# Altium schematic sheet Front End.SchDoc
size 406 x 304 mm; SheetNumber: 5; SheetTotal: 6
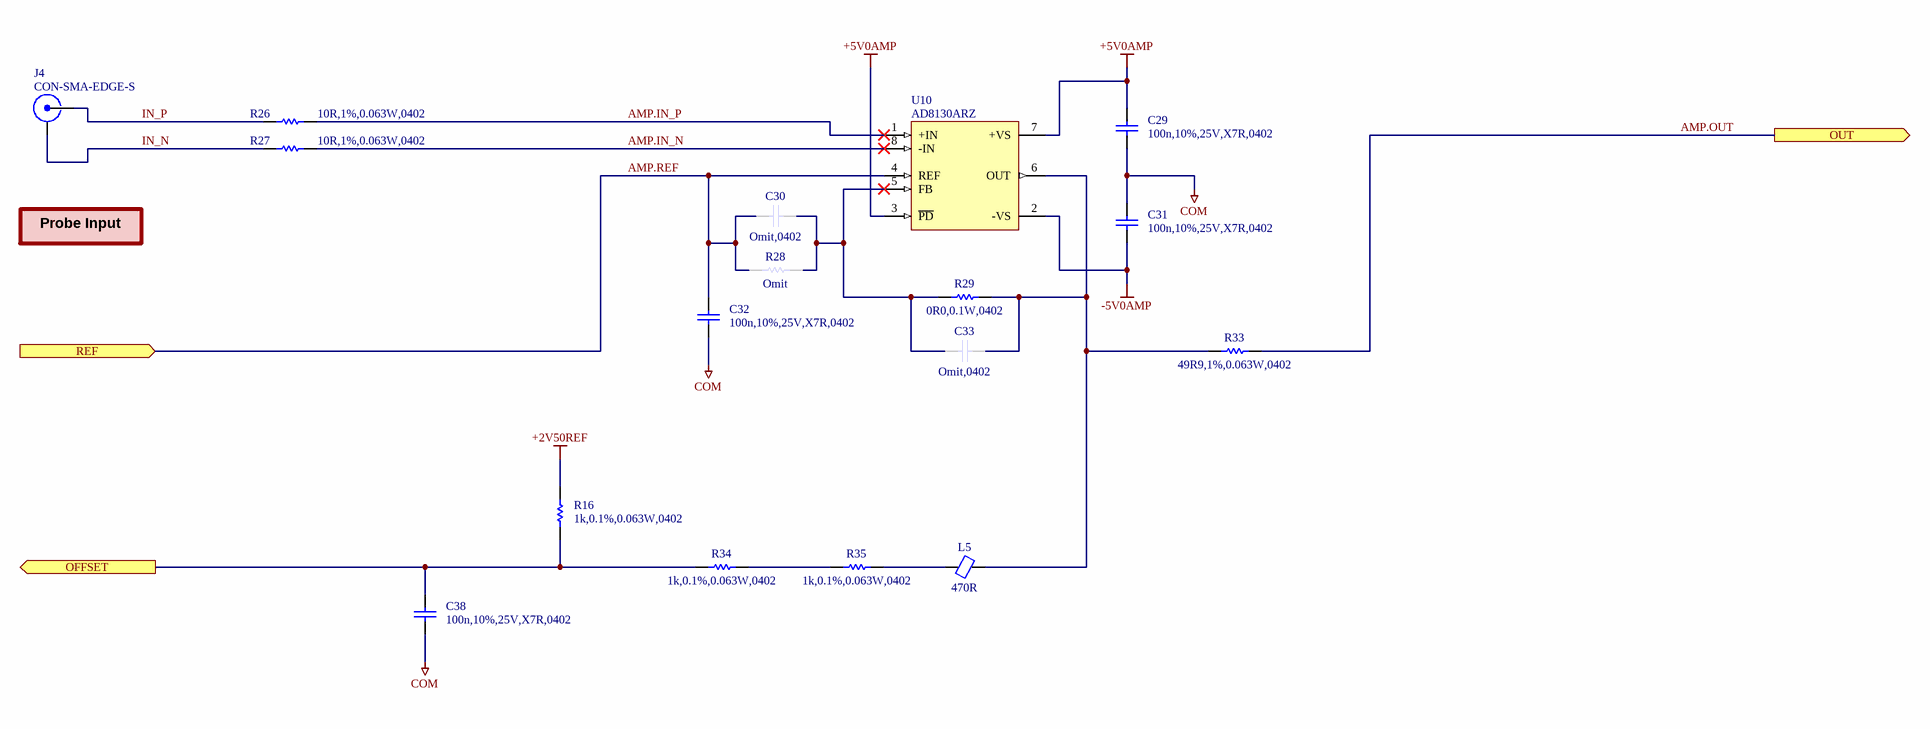
[diagram p0: Front End.SchDoc]

## Parts
C29  100n,10%,25V,X7R,0402  [CAPC1005X06N]
C30  Omit,0402  [CAPC1005X06N]  (no BOM)
C31  100n,10%,25V,X7R,0402  [CAPC1005X06N]
C32  100n,10%,25V,X7R,0402  [CAPC1005X06N]
C33  Omit,0402  [CAPC1005X06N]  (no BOM)
C38  100n,10%,25V,X7R,0402  [CAPC1005X06N]
J4  CON-SMA-EDGE-S  [RFSOLUTIONS_CON-SMA-EDGE-S]
L5  470R  [INDC1005X05N]
R16  1k,0.1%,0.063W,0402  [RESC1005X04N]
R26  10R,1%,0.063W,0402  [RESC1005X04N]
R27  10R,1%,0.063W,0402  [RESC1005X04N]
R28  Omit  [RESC1005X04N]  (no BOM)
R29  0R0,0.1W,0402  [RESC1005X04N]
R33  49R9,1%,0.063W,0402  [RESC1005X04N]
R34  1k,0.1%,0.063W,0402  [RESC1005X04N]
R35  1k,0.1%,0.063W,0402  [RESC1005X04N]
U10  AD8130ARZ  [ANALOGDEVICES_PKG_R-8]

## Ports
OFFSET (out), OUT (out), REF (in)

## Nets
+2V50REF: R16.2
+5V0AMP: C29.2 U10.3(~{PD}) U10.7(+VS)
-5V0AMP: C31.1 U10.2(-VS)
COM: C29.1 C31.2 C32.1 C38.1
AMP.IN_N: R27.2 U10.8(-IN)
AMP.IN_P: R26.2 U10.1(+IN)
AMP.OUT: R33.2 ; port OUT
AMP.REF: C30.1 C32.2 R28.1 U10.4(REF) ; port REF
IN_N: J4.2(GND) R27.1
IN_P: J4.1(RF) R26.1
OFFSET: C38.2 R16.1 R34.1 ; port OFFSET
NetC30_2: C30.2 C33.1 R28.2 R29.1 U10.5(FB)
NetC33_2: C33.2 L5.2 R29.2 R33.1 U10.6(OUT)
NetL5_1: L5.1 R35.2
NetR34_2: R34.2 R35.1

## Notes on the sheet
- Probe Input
- Sheet Name:
- Date:
- Sheet
- Designer:
- of

## Library data of the parts
C29 C31 C32 C38 = CAP,Cer,100nF,10%,25V,X7R,0402: 0.1ï¿½F ï¿½10% 25V Ceramic Capacitor X7R 0402 (1005 Metric); Manufacturer 1: Murata Electronics; Manufacturer 1 Part Number: GRM155R71E104KE14J; Vendor 1 Part Number: 490-14603-1-ND; Vendor 1: DigiKey; Value: 100nF; Part Name: CAP,Cer,100nF,10%,25V,X7R,0402; CreatedBy: Judd Foster; HelpURL: https://search.murata.co.jp/Ceramy/image/img/A01X/G101/ENG/GRM155R71E104KE14-01.pdf
C30 C33 = CAP,Omit,0402: Omit; Part Name: CAP,Omit,0402; CreatedBy: Judd Foster; HelpURL: N/A; Manufacturer 1: N/A; Manufacturer 1 Part Number: N/A; Vendor 1: N/A; Vendor 1 Part Number: N/A; Value: Omit
J4 = Conn,RF,SMA,Fem,50R,Edge,SMD: SMA Connector Jack, Female Socket Board Edge, End Launch Solder; Manufacturer 1: RF Solutions; Vendor 1 Part Number: CON-SMA-EDGE-S-ND; Vendor 1: DigiKey; Part Name: Conn,RF,SMA,Fem,50R,Edge,SMD; CreatedBy: Judd Foster; HelpURL: https://www.rfsolutions.co.uk/content/download-files/CON-SMA-EDGE-6-DATASHEET.pdf; Manufacturer 1 Part Number: CON-SMA-EDGE-S
L5 = Ferrite,470R@100MHz,0402: 470 Ohms @ 100 MHz 1 Power Line Ferrite Bead 0402 (1005 Metric) 1A 200mOhm; Manufacturer 1: Murata Electronics; Manufacturer 1 Part Number: BLM15PX471SN1D; Vendor 1 Part Number: 490-10662-1-ND; Vendor 1: Digikey; Part Name: Ferrite,470R@100MHz,0402; CreatedBy: Judd Foster; HelpURL: https://www.murata.com/en-us/products/productdata/8796740059166/ENFA0018.pdf; Value: 470R
R16 R34 R35 = RES,1k,0.1%,0.063W,0402: 1 kOhms Â±0.1% 0.063W, 1/16W Chip Resistor 0402 (1005 Metric) Thin Film; Manufacturer 1: YAGEO; Manufacturer 1 Part Number: RT0402BRE071KL; Vendor 1 Part Number: YAG2306CT-ND; Vendor 1: DigiKey; Part Name: RES,1k,0.1%,0.063W,0402; CreatedBy: Judd Foster; HelpURL: https://www.yageo.com/upload/media/product/app/datasheet/rchip/pyu-rt_1-to-0.01_rohs_l.pdf; Value: 1k
R26 R27 = RES,10R,1%,0.063W,0402: 10 Ohms ï¿½1% 0.063W, 1/16W Chip Resistor 0402 (1005 Metric) Automotive AEC-Q200 Thick Film; Manufacturer 1: Panasonic Electronic Components; Manufacturer 1 Part Number: ERJ-2RKF10R0X; Vendor 1 Part Number: P10.0LCT-ND; Vendor 1: Digikey; Part Name: RES,10R,1%,0.063W,0402; CreatedBy: Judd Foster; HelpURL: https://industrial.panasonic.com/cdbs/www-data/pdf/RDA0000/AOA0000C304.pdf; Value: 10R
R28 = RES,Omit,0402: Part Name: RES,Omit,0402; CreatedBy: Judd Foster; HelpURL: N/A; Manufacturer 1: N/A; Manufacturer 1 Part Number: N/A; Vendor 1: N/A; Vendor 1 Part Number: N/A; Value: Omit
R29 = RES,0R0,0.1W,0402: 0 Ohms Jumper 0.1W, 1/10W Chip Resistor 0402 (1005 Metric) Automotive AEC-Q200 Thick Film; Manufacturer 1: Panasonic Electronic Components; Manufacturer 1 Part Number: ERJ-2GE0R00X; Vendor 1 Part Number: P0.0JCT-ND; Vendor 1: Digikey; Value: 0R; Part Name: RES,0R0,0.1W,0402; CreatedBy: Judd Foster; HelpURL: https://industrial.panasonic.com/cdbs/www-data/pdf/RDA0000/AOA0000C301.pdf
R33 = RES,49R9,1%,0.063W,0402: 49.9 Ohms Â±1% 0.063W, 1/16W Chip Resistor 0402 (1005 Metric) Moisture Resistant Thick Film; Manufacturer 1: YAGEO; Manufacturer 1 Part Number: RC0402FR-0749R9L; Vendor 1 Part Number: 311-49.9LRCT-ND; Vendor 1: DigiKey; Part Name: RES,49R9,1%,0.063W,0402; CreatedBy: Judd Foster; HelpURL: https://www.yageo.com/upload/media/product/products/datasheet/rchip/PYu-RC_Group_51_RoHS_L_12.pdf; Value: 49R9
U10 = AD8130ARZ: Differential Amplifier 1 Circuit 8-SOIC; Manufacturer 1: Analog Devices; Vendor 1 Part Number: 505-AD8130ARZ-ND; Vendor 1: DigiKey; Part Name: AD8130ARZ; CreatedBy: Judd Foster; HelpURL: https://www.analog.com/media/en/technical-documentation/data-sheets/AD8129_8130.pdf; Manufacturer 1 Part Number: AD8130ARZ